# Altium project SJ2088POE.PrjPcb (part 9 of 9)

## Sheet SJ2088POE_IMU.SchDoc: =project_title
size Tabloid; CompanyName: Luxonis Holding; DrawnBy: Brian Weinstein / Sandesh Joshi; Organization: Luxonis Holding; Address1: 1925 Harmony Park Drive; Address2: Westminster, CO; Address3: 80234; Address4: United States; DocumentNumber: D2088000; SheetNumber: 4; SheetTotal: 11
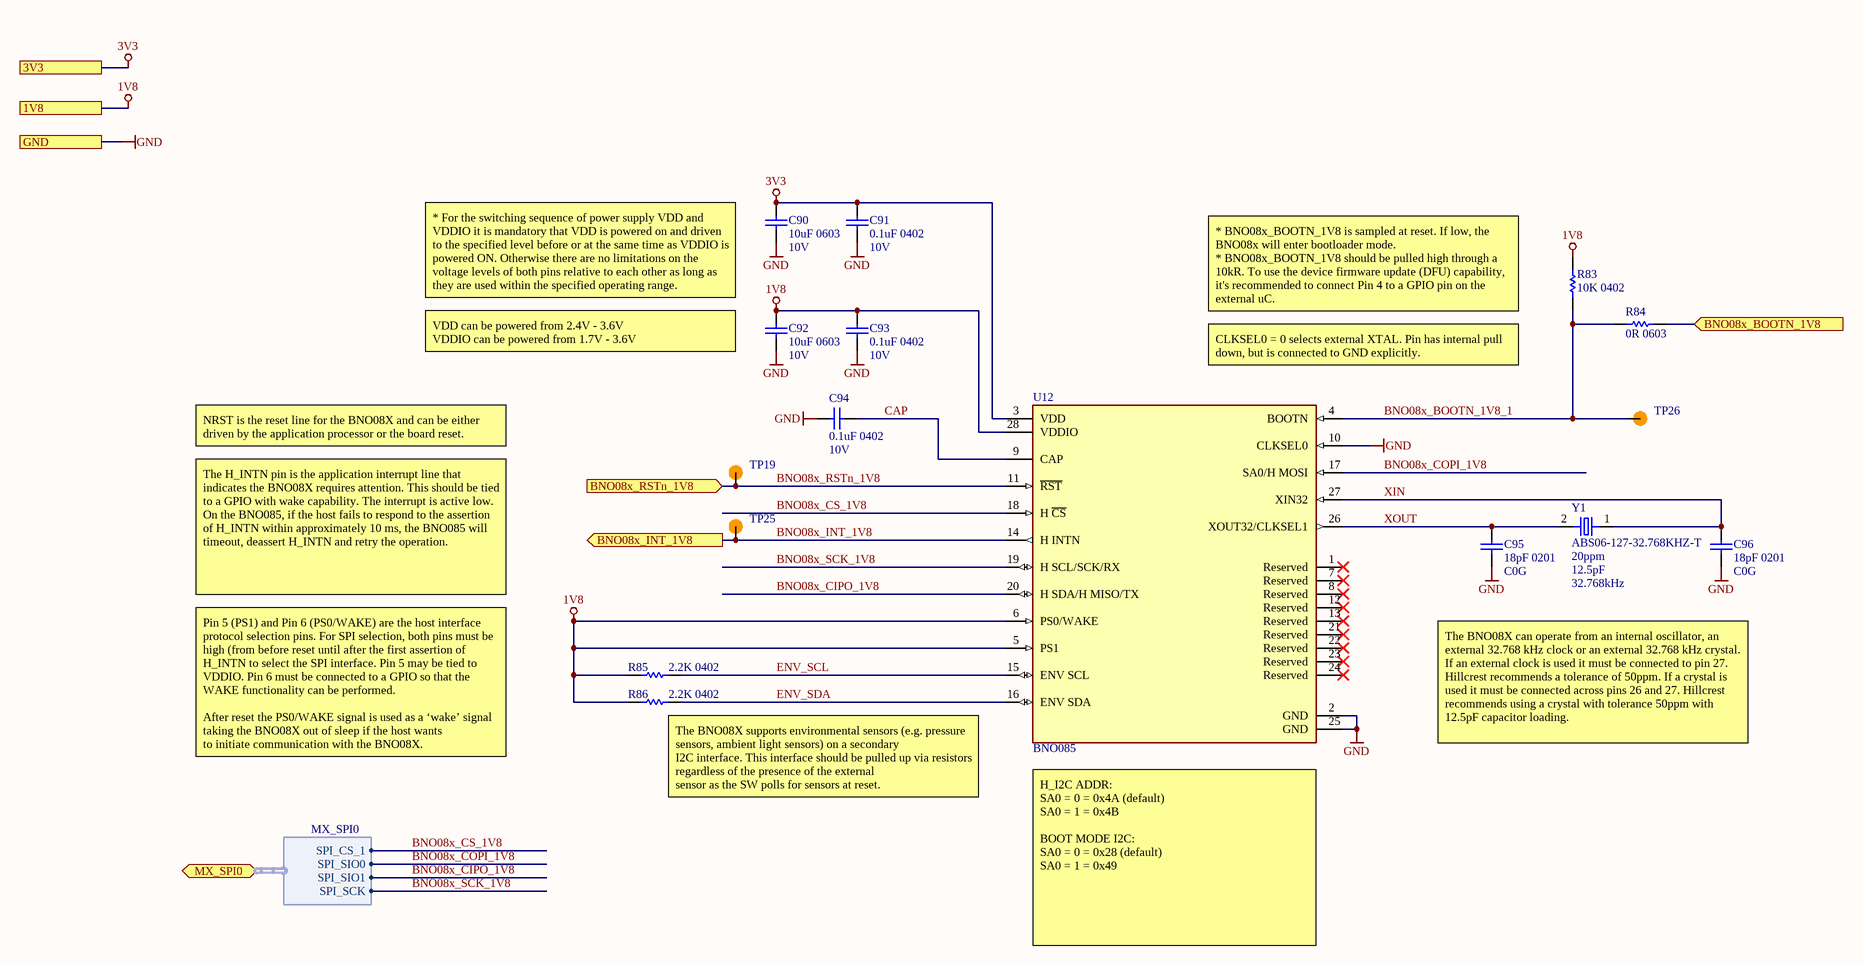
[diagram p14: SJ2088POE_IMU.SchDoc]

### Parts
C90  10uF 0603  Voltage Rating: 10V  [CAPC0603(1608)100_L]
C91  0.1uF 0402  Voltage Rating: 10V  [CAPC0402(1005)70_L]
C92  10uF 0603  Voltage Rating: 10V  [CAPC0603(1608)100_L]
C93  0.1uF 0402  Voltage Rating: 10V  [CAPC0402(1005)70_L]
C94  0.1uF 0402  Voltage Rating: 10V  [CAPC0402(1005)70_L]
C95  18pF 0201  Dielectric: C0G  [CAPC0201(0603)33_L]
C96  18pF 0201  Dielectric: C0G  [CAPC0201(0603)33_L]
R83  10K 0402  [RESC0402(1005)_L]
R84  0R 0603  [RESC0603(1608)_L]
R85  2.2K 0402  [RESC0402(1005)_L]
R86  2.2K 0402  [RESC0402(1005)_L]
TP19  TP100_200_NS  [TP100_200_NS]  (value not drawn)  (no BOM)
TP25  TP100_200_NS  [TP100_200_NS]  (value not drawn)  (no BOM)
TP26  TP100_200_NS  [TP100_200_NS]  (value not drawn)  (no BOM)
U12  BNO085  [BNO085]
Y1  ABS06-127-32.768KHZ-T  Frequency Tolerance: 20ppm  Load Capacitance: 12.5pF  Frequency: 32.768kHz  [ABS06-127-32.768KHZ-T]

### Ports
1V8, 3V3, BNO08x_BOOTN_1V8 (in), BNO08x_INT_1V8 (out), BNO08x_RSTn_1V8 (in), GND, MX_SPI0 (bidir, harness MX_SPI0)

### Harnesses
MX_SPI0: SPI_SIO0, SPI_SIO1, SPI_CS_1, SPI_SCK

### Nets
1V8: C92.2 C93.2 R83.2 R85.1 R86.1 U12.5(PS1) U12.6(PS0/WAKE) U12.28(VDDIO) ; port 1V8
3V3: C90.2 C91.2 U12.3(VDD) ; port 3V3
GND: C90.1 C91.1 C92.1 C93.1 C94.2 C95.1 C96.1 U12.2(GND) U12.10(CLKSEL0) U12.25(GND) ; port GND
BNO08x_BOOTN_1V8: R84.2 ; port BNO08x_BOOTN_1V8
BNO08x_BOOTN_1V8_1: R83.1 R84.1 TP26.1 U12.4(BOOTN)
BNO08x_CIPO_1V8: U12.20(H_SDA/H_MISO/TX) ; port MX_SPI0.SPI_SIO1
BNO08x_COPI_1V8: U12.17(SA0/H_MOSI) ; port MX_SPI0.SPI_SIO0
BNO08x_CS_1V8: U12.18(H_~{CS}) ; port MX_SPI0.SPI_CS_1
BNO08x_INT_1V8: TP25.1 U12.14(H_INTN) ; port BNO08x_INT_1V8
BNO08x_RSTn_1V8: TP19.1 U12.11(~{RST}) ; port BNO08x_RSTn_1V8
BNO08x_SCK_1V8: U12.19(H_SCL/SCK/RX) ; port MX_SPI0.SPI_SCK
CAP: C94.1 U12.9(CAP)
ENV_SCL: R85.2 U12.15(ENV_SCL)
ENV_SDA: R86.2 U12.16(ENV_SDA)
XIN: C96.2 U12.27(XIN32) Y1.1
XOUT: C95.2 U12.26(XOUT32/CLKSEL1) Y1.2

Not connected (* = marked no-connect by the designer): U12 1(Reserved)* 7(Reserved)* 8(Reserved)* 12(Reserved)* 13(Reserved)* 21(Reserved)* 22(Reserved)* 23(Reserved)* 24(Reserved)*

### Notes on the sheet
- * For the switching sequence of power supply VDD and VDDIO it is mandatory that VDD is powered on and driven to the specified level before or at the same time as VDDIO is powered ON. Otherwise there are no limitations on the voltage levels of both pins relative to each other as long as they are used within the specified operating range.
- (near C92) VDD can be powered from 2.4V - 3.6V
  VDDIO can be powered from 1.7V - 3.6V
- * BNO08x_BOOTN_1V8 is sampled at reset. If low, the BNO08x will enter bootloader mode.
  * BNO08x_BOOTN_1V8 should be pulled high through a 10kR. To use the device firmware update (DFU) capability, it's recommended to connect Pin 4 to a GPIO pin on the external uC.
- CLKSEL0 = 0 selects external XTAL. Pin has internal pull down, but is connected to GND explicitly.
- NRST is the reset line for the BNO08X and can be either driven by the application processor or the board reset.
- The H_INTN pin is the application interrupt line that indicates the BNO08X requires attention. This should be tied to a GPIO with wake capability. The interrupt is active low. On the BNO085, if the host fails to respond to the assertion of H_INTN within approximately 10 ms, the BNO085 will timeout, deassert H_INTN and retry the operation.
- Pin 5 (PS1) and Pin 6 (PS0/WAKE) are the host interface protocol selection pins. For SPI selection, both pins must be high (from before reset until after the first assertion of H_INTN to select the SPI interface. Pin 5 may be tied to VDDIO. Pin 6 must be connected to a GPIO so that the WAKE functionality can be performed.
  After reset the PS0/WAKE signal is used as a ‘wake’ signal taking the BNO08X out of sleep if the host wants
  to initiate communication with the BNO08X.
- The BNO08X can operate from an internal oscillator, an external 32.768 kHz clock or an external 32.768 kHz crystal. If an external clock is used it must be connected to pin 27. Hillcrest recommends a tolerance of 50ppm. If a crystal is used it must be connected across pins 26 and 27. Hillcrest recommends using a crystal with tolerance 50ppm with 12.5pF capacitor loading.
- (near R86) The BNO08X supports environmental sensors (e.g. pressure sensors, ambient light sensors) on a secondary
  I2C interface. This interface should be pulled up via resistors regardless of the presence of the external
  sensor as the SW polls for sensors at reset.
- (near U12) H_I2C ADDR:
  SA0 = 0 = 0x4A (default)
  SA0 = 1 = 0x4B
  BOOT MODE I2C:
  SA0 = 0 = 0x28 (default)
  SA0 = 1 = 0x49
- Title
- Size:
- Date:
- Tabloid
- Number:
- Time:
- Revision:
- Sheet
- of
- Drawn by:

### Library data of the parts
C90 C92 = GRM188R61A106ME69D: CAP CER 10UF 10V X5R 0603 20%; Manufacturer 1: Murata; Material: Ceramic; Supplier 1: Digi-Key; Manufacturer Part Number 1: GRM188R61A106ME69D; Stock 1: 2873098; Pricing 1: 1=0.21000, 10=0.14100, 100=0.07130, 500=0.04876, 1000=0.04313 (USD); RoHS: Yes; Mount: Surface Mount; Case/Package: 0603; Weight: 0.000222oz; Case Code (Metric): 1608; Case Code (Imperial): 0603; Min Operating Temperature: -55°C; Max Operating Temperature: 85°C; Packaging: Tape and Reel; Tolerance: 20%; Capacitance: 10uF; Dielectric: X5R; Voltage Rating (DC): 10V; Package Quantity: 4000; Termination: SMD/SMT; Length: 1.6mm; Height: 0.8mm; Width: 0.8mm; Thickness: 0.035inch; Depth: 0.8mm; REACH SVHC: Unknown; Lead Free: Lead Free; ComponentLink1URL: http://www.mouser.com/ds/2/281/c02e-2905.pdf?src-supplier=Mouser; ComponentLink1Description: http://www.mouser.com/ds/2/281/c02e-2905.pdf?src-supplier=Mouser; ComponentLink2URL: http://components.arrow.com/part/dataview/0323_06119472?src-supplier=Arrow+Europe; ComponentLink2Description: http://components.arrow.com/part/dataview/0323_06119472?src-supplier=Arrow+Europe; ComponentLink3URL: http://www.farnell.com/datasheets/2048014.pdf?src-supplier=Farnell; ComponentLink3Description: http://www.farnell.com/datasheets/2048014.pdf?src-supplier=Farnell; ComponentLink4URL: http://www.farnell.com/datasheets/1872210.pdf?src-supplier=Farnell; ComponentLink4Description: http://www.farnell.com/datasheets/1872210.pdf?src-supplier=Farnell; ComponentLink5URL: http://search.murata.co.jp/Ceramy/image/img/A01X/G101/ENG/GRM188R61A106ME69-01.pdf?src-supplier=Digi-Key; ComponentLink5Description: http://search.murata.co.jp/Ceramy/image/img/A01X/G101/ENG/GRM188R61A106ME69-01.pdf?src-supplier=Digi-Key; ComponentLink6URL: http://www.farnell.com/datasheets/1872210.pdf?src-supplier=Newark; ComponentLink6Description: http://www.farnell.com/datasheets/1872210.pdf?src-supplier=Newark; ComponentLink7URL: http://www.farnell.com/datasheets/2048014.pdf?src-supplier=Element14; ComponentLink7Description: http://www.farnell.com/datasheets/2048014.pdf?src-supplier=Element14; ComponentLink8URL: http://www.farnell.com/datasheets/2048014.pdf?src-supplier=Newark; ComponentLink8Description: http://www.farnell.com/datasheets/2048014.pdf?src-supplier=Newark; Supplier Part Number 1: 490-10475-1-ND
C91 C93 C94 = GRM155R71A104JA01D: CAP CER 0.1UF 10V X7R 0402 5%; Manufacturer 1: Murata; Capacitance: 100nF; Supplier 1: Digi-Key; Manufacturer Part Number 1: GRM155R71A104JA01D; Stock 1: 1346709; Pricing 1: 1=0.10000, 10=0.02500, 100=0.01130, 500=0.00806, 1000=0.00633, 2500=0.00575, 5000=0.00529 (USD); RoHS: Yes; Mount: Surface Mount; Case/Package: 0402; Case Code (Imperial): 0402; Case Code (Metric): 1005; Min Operating Temperature: -55°C; Max Operating Temperature: 125°C; Tolerance: 5%; Packaging: Tape and Reel; Voltage Rating (DC): 10V; Dielectric: X7R; Package Quantity: 10000; Termination: SMD/SMT; Length: 1mm; Height: 0.5mm; Width: 0.02inch; Thickness: 0.022inch; Depth: 0.5mm; Radiation Hardening: No; Lead Free: Lead Free; ComponentLink1URL: https://datasheet.ciiva.com/5411/product-5411135.pdf?src-supplier=Mouser; ComponentLink1Description: https://datasheet.ciiva.com/5411/product-5411135.pdf?src-supplier=Mouser; ComponentLink2URL: https://datasheet.ciiva.com/11618/c02e-11618821.pdf?src-supplier=Avnet; ComponentLink2Description: https://datasheet.ciiva.com/11618/c02e-11618821.pdf?src-supplier=Avnet; Supplier Part Number 1: 490-10777-1-ND
C95 C96 = GRM0335C1E180FA01D: Cap Ceramic 18pF 25V C0G 1% Pad SMD 0201 125C T/R; Manufacturer 1: Murata; Supplier 1: Digi-Key; Manufacturer Part Number 1: GRM0335C1E180FA01D; RoHS: Yes; Category: Ceramic Capacitors; Stock 1: 27511; Pricing 1: 1=0.10000, 10=0.02100, 100=0.00930, 500=0.00666, 1000=0.00523, 2500=0.00476, 5000=0.00438 (USD); Mount: Surface Mount; Case/Package: 0201; Case Code (Imperial): 0201; Case Code (Metric): 0603; Min Operating Temperature: -55°C; Max Operating Temperature: 125°C; Capacitance: 18pF; Tolerance: 1%; Packaging: Tape and Reel; Voltage Rating (DC): 25V; Package Quantity: 15000; Voltage Rating: 25V; Termination: SMD/SMT; Length: 0.024inch; Height: 0.3mm; Thickness: 0.013inch; Width: 0.3mm; ComponentLink1URL: https://datasheet.ciiva.com/29538/partnumbering-e-01-29538328.pdf?src-supplier=Digi-Key; ComponentLink1Description: https://datasheet.ciiva.com/29538/partnumbering-e-01-29538328.pdf?src-supplier=Digi-Key; Supplier 2: Digi-Key; Supplier 3: Mouser; Supplier Part Number 3: 81-GRM0335C1E180FA1D; Supplier Part Number 2: 490-17804-2-ND; Supplier Part Number 1: 490-17804-1-ND
R83 = RC0402FR-1310KL: RES SMD 10K OHM 1% 0402 1/16W Chip Resistor, 0402 [1005 Metric], 10 kohm, RC Series, 50 V, Thick Film, 62.5 mW; Manufacturer 1: Yageo; Resistance: 10kR; Temperature Coefficient: 100ppm/°C; Power Rating: 62.5mW; Voltage Rating: 50V; ComponentLink1URL: https://datasheet.ciiva.com/16940/pyu-rc0402-51-rohs-l-6-16940293.pdf?src-supplier=Avnet+Europe; ComponentLink1Description: https://datasheet.ciiva.com/16940/pyu-rc0402-51-rohs-l-6-16940293.pdf?src-supplier=Avnet+Europe; ComponentLink2URL: https://datasheet.ciiva.com/28386/pyu-rc0402-51-rohs-l-6-28386855.pdf?src-supplier=Avnet+Europe; ComponentLink2Description: https://datasheet.ciiva.com/28386/pyu-rc0402-51-rohs-l-6-28386855.pdf?src-supplier=Avnet+Europe; ComponentLink3URL: https://datasheet.ciiva.com/16740/pyu-rc0402-51-rohs-l-6-r-16740602.pdf?src-supplier=Future+Electronics; ComponentLink3Description: https://datasheet.ciiva.com/16740/pyu-rc0402-51-rohs-l-6-r-16740602.pdf?src-supplier=Future+Electronics; ComponentLink4URL: https://datasheet.ciiva.com/8891/pyu-rc0402-51-rohs-l-6-8891339.pdf?src-supplier=Avnet; ComponentLink4Description: https://datasheet.ciiva.com/8891/pyu-rc0402-51-rohs-l-6-8891339.pdf?src-supplier=Avnet; ComponentLink5URL: https://datasheet.ciiva.com/5557/pyu-rc0402-51-rohs-l-6-r-5557997.pdf?src-supplier=Mouser; ComponentLink5Description: https://datasheet.ciiva.com/5557/pyu-rc0402-51-rohs-l-6-r-5557997.pdf?src-supplier=Mouser; ComponentLink6URL: https://datasheet.ciiva.com/7983/1018594-7983533.pdf?src-supplier=Element14; ComponentLink6Description: https://datasheet.ciiva.com/7983/1018594-7983533.pdf?src-supplier=Element14; Supplier 1: Newark; Manufacturer Part Number 1: RC0402FR-1310KL; Stock 1: 62239; Pricing 1: 1=0.10000, 25=0.01200, 100=0.00400, 250=0.00400, 500=0.00300, 1000=0.00300 (USD); RoHS: Yes; Case/Package: 0402; Number of Pins: 2; Contact Plating: Tin,Matte,Lead; Case Code (Imperial): 0402; Case Code (Metric): 1005; Min Operating Temperature: -55°C; Max Operating Temperature: 155°C; Tolerance: 1%; Composition: Thick Film; Packaging: Tape and Reel; Termination: SMD/SMT; Military Standard: Not; Voltage Rating (DC): 50V; Working Voltage: 50V; Number of Terminations: 2; Length: 1mm; Depth: 0.5mm; Radiation Hardening: No; REACH SVHC: No SVHC; Lead Free: Lead Free; Supplier Part Number 1: 67R9960; Supplier 2: Future Electronics; Supplier 3: Mouser; Supplier 4: Element14; Supplier Part Number 2: RC0402FR-1310KL-CUTT; Supplier Part Number 3: 603-RC0402FR-1310KL; Supplier Part Number 4: 1799235
R84 = CRCW06030000Z0EA: RES SMD 0 OHM JUMPER 1/10W 0603 0 Ohms Jumper 0.1W, 1/10W Chip Resistor 0603 (1608 Metric) Automotive AEC-Q200 Thick Film; Manufacturer 1: Vishay; Manufacturer Part Number 1: CRCW0603-0000Z0EA; Resistance: 0mR; Power Rating: 100mW; Voltage Rating: 75V; Temperature Coefficient: 100ppm/°C; Tolerance: 5%; Current Rating: 2A; Supplier 1: Digi-Key; Stock 1: 742743; Pricing 1: 1=0.100000, 10=0.034000, 25=0.024400, 50=0.018600, 100=0.013800, 250=0.010480, 500=0.008400, 1000=0.006180 (USD); RoHS: Yes; Mount: Surface Mount; Case/Package: 0603; Weight: 7.1E-05oz; Contact Plating: Tin,Lead; Case Code (Metric): 1608; Case Code (Imperial): 0603; Min Operating Temperature: -55°C; Max Operating Temperature: 155°C; Composition: Thick Film; Termination: SMD/SMT; Packaging: Tape and Reel; Package Quantity: 1; Number of Terminations: 2; Military Standard: Not; Max Power Dissipation: 100mW; Voltage Rating (DC): 75V; Features: Automotive AEC-Q200; Working Voltage: 75V; Length: 1.55mm; Height: 0.02inch; Width: 0.033inch; Depth: 0.85mm; Radiation Hardening: No; Lead Free: Lead Free; REACH SVHC: Unknown; ComponentLink1URL: https://datasheet.ciiva.com/2461/dcrcwe3-2461968.pdf?src-supplier=Digi-Key; ComponentLink1Description: https://datasheet.ciiva.com/2461/dcrcwe3-2461968.pdf?src-supplier=Digi-Key; ComponentLink2URL: https://datasheet.ciiva.com/2461/dcrcwe3-2461969.pdf?src-supplier=Digi-Key; ComponentLink2Description: https://datasheet.ciiva.com/2461/dcrcwe3-2461969.pdf?src-supplier=Digi-Key; ComponentLink3URL: https://datasheet.ciiva.com/2461/dcrcwe3-2461970.pdf?src-supplier=Digi-Key; ComponentLink3Description: https://datasheet.ciiva.com/2461/dcrcwe3-2461970.pdf?src-supplier=Digi-Key; ComponentLink4URL: https://datasheet.ciiva.com/8340/dcrcwe3-8340197.pdf?src-supplier=Avnet; ComponentLink4Description: https://datasheet.ciiva.com/8340/dcrcwe3-8340197.pdf?src-supplier=Avnet; ComponentLink5URL: https://datasheet.ciiva.com/16941/dcrcw-16941302.pdf?src-supplier=Avnet+Europe; ComponentLink5Description: https://datasheet.ciiva.com/16941/dcrcw-16941302.pdf?src-supplier=Avnet+Europe; ComponentLink6URL: https://datasheet.ciiva.com/16199/dcrcwe3-16199063.pdf?src-supplier=Future+Electronics; ComponentLink6Description: https://datasheet.ciiva.com/16199/dcrcwe3-16199063.pdf?src-supplier=Future+Electronics; ComponentLink7URL: https://datasheet.ciiva.com/16725/70201119-16725175.pdf?src-supplier=Allied+Electronics; ComponentLink7Description: https://datasheet.ciiva.com/16725/70201119-16725175.pdf?src-supplier=Allied+Electronics; ComponentLink8URL: https://datasheet.ciiva.com/26316/fld-crcw-e3-data-en-26316615.pdf?src-supplier=Distrelec; ComponentLink8Description: https://datasheet.ciiva.com/26316/fld-crcw-e3-data-en-26316615.pdf?src-supplier=Distrelec; ComponentLink9URL: https://datasheet.ciiva.com/5544/dcrcwe3-109170-5544344.pdf?src-supplier=Mouser; ComponentLink9Description: https://datasheet.ciiva.com/5544/dcrcwe3-109170-5544344.pdf?src-supplier=Mouser; ComponentLink10URL: https://datasheet.ciiva.com/7841/1720486-7841816.pdf?src-supplier=Element14; ComponentLink10Description: https://datasheet.ciiva.com/7841/1720486-7841816.pdf?src-supplier=Element14; ComponentLink11URL: https://datasheet.ciiva.com/7841/1720486-7841817.pdf?src-supplier=Element14; ComponentLink11Description: https://datasheet.ciiva.com/7841/1720486-7841817.pdf?src-supplier=Element14; ComponentLink12URL: https://datasheet.ciiva.com/7841/125364-7841818.pdf?src-supplier=Element14; ComponentLink12Description: https://datasheet.ciiva.com/7841/125364-7841818.pdf?src-supplier=Element14; ComponentLink13URL: https://datasheet.ciiva.com/16721/70201119-16721450.pdf?src-supplier=Allied+Electronics; ComponentLink13Description: https://datasheet.ciiva.com/16721/70201119-16721450.pdf?src-supplier=Allied+Electronics; Supplier Part Number 1: 541-0.0GCT-ND
R85 R86 = RC0402FR-072K2L: RES SMD 2.2K OHM 1% 1/16W 0402; Manufacturer 1: Yageo; Resistance: 2.2kR; Temperature Coefficient: 100ppm/°C; Power Rating: 63mW; Voltage Rating: 50V; Supplier 1: Digi-Key; Manufacturer Part Number 1: RC0402FR-072K2L; Stock 1: 12579098; Pricing 1: 1=0.10000, 10=0.01600, 100=0.00640, 1000=0.00289, 2500=0.00251, 5000=0.00207 (USD); RoHS: Yes; Case/Package: 0402; Weight: 2.3E-05oz; Case Code (Imperial): 0402; Case Code (Metric): 1005; Min Operating Temperature: -55°C; Max Operating Temperature: 155°C; Packaging: Tape and Reel; Tolerance: 1%; Composition: Thick Film; Termination: SMD/SMT; Military Standard: Not; Length: 1mm; Height: 0.35mm; Width: 0.5mm; Depth: 0.5mm; Lead Free: Lead Free; REACH SVHC: Unknown; ComponentLink1URL: https://datasheet.ciiva.com/11808/0900766b80c66297-11808786.pdf?src-supplier=RSComponents; ComponentLink1Description: https://datasheet.ciiva.com/11808/0900766b80c66297-11808786.pdf?src-supplier=RSComponents; ComponentLink2URL: https://datasheet.ciiva.com/12577/pyu-rc0402-51-rohs-l-6-r-12577429.pdf?src-supplier=Mouser; ComponentLink2Description: https://datasheet.ciiva.com/12577/pyu-rc0402-51-rohs-l-6-r-12577429.pdf?src-supplier=Mouser; ComponentLink3URL: https://datasheet.ciiva.com/16741/pyu-rc0402-51-rohs-l-6-r-16741015.pdf?src-supplier=Future+Electronics; ComponentLink3Description: https://datasheet.ciiva.com/16741/pyu-rc0402-51-rohs-l-6-r-16741015.pdf?src-supplier=Future+Electronics; ComponentLink4URL: https://datasheet.ciiva.com/7983/1018594-7983515.pdf?src-supplier=Element14; ComponentLink4Description: https://datasheet.ciiva.com/7983/1018594-7983515.pdf?src-supplier=Element14; ComponentLink5URL: https://datasheet.ciiva.com/46383/1018594-46383563.pdf?src-supplier=Element14; ComponentLink5Description: https://datasheet.ciiva.com/46383/1018594-46383563.pdf?src-supplier=Element14; ComponentLink6URL: https://datasheet.ciiva.com/7849/1018594-7849928.pdf?src-supplier=Element14; ComponentLink6Description: https://datasheet.ciiva.com/7849/1018594-7849928.pdf?src-supplier=Element14; ComponentLink7URL: https://datasheet.ciiva.com/7849/1018594-7849929.pdf?src-supplier=Element14; ComponentLink7Description: https://datasheet.ciiva.com/7849/1018594-7849929.pdf?src-supplier=Element14; Supplier 2: Mouser; Supplier 3: Newark; Supplier Part Number 1: 311-2.20KLRCT-ND; Supplier Part Number 2: 603-RC0402FR-072K2L; Supplier Part Number 3: 98K7523
TP19 TP25 TP26 = TEST_POINT
U12 = BNO085: IMU ACCEL/GYRO/MAG I2C 32BIT; Manufacturer 1: Hillcrest Laboratories; Sensor Type: Accelerometer,Gyroscope,Magnetometer; Output Type: SPI,I2C; Supplier 1: Digi-Key; Manufacturer Part Number 1: BNO085; RoHS: No; Category: Inertial Measurement Units (IMUs); Stock 1: 11593; Pricing 1: 1=11.85000, 5=10.31200, 10=9.28100, 25=8.25000, 50=7.63120, 100=6.60000, 500=6.18750, 1000=5.77500 (USD); Mount: Surface Mount; Case/Package: LGA; Min Operating Temperature: -40°C; Max Operating Temperature: 85°C; Packaging: Tape and Reel; ComponentLink1URL: https://www.hillcrestlabs.com/downloads/bno080-datasheet?src-supplier=Digi-Key; ComponentLink1Description: https://www.hillcrestlabs.com/downloads/bno080-datasheet?src-supplier=Digi-Key; ComponentLink2URL: https://www.hillcrestlabs.com/downloads/bno080-migration-guide?src-supplier=Digi-Key; ComponentLink2Description: https://www.hillcrestlabs.com/downloads/bno080-migration-guide?src-supplier=Digi-Key; Supplier Part Number 1: 1888-1006-1-ND
Y1 = ABS06-127-32.768KHZ-T: CRYSTAL 32.768kHz ±20ppm Crystal 12.5pF 90 kOhms 2-SMD, No Lead; Manufacturer 1: Abracon; ESR (Equivalent Series Resistance): 90kR; Supplier 1: Digi-Key; Manufacturer Part Number 1: ABS06-127-32.768KHZ-T; RoHS: Yes; Stock 1: 1640; Pricing 1: 1=0.69000, 10=0.60700, 50=0.56760, 100=0.50160, 500=0.47520, 1000=0.39600 (USD); Mount: Surface Mount; Case/Package: SMD/SMT; Min Operating Temperature: -40°C; Max Operating Temperature: 85°C; Packaging: Tape and Reel; ComponentLink1URL: http://www.farnell.com/datasheets/2614114.pdf?src-supplier=Farnell; ComponentLink1Description: http://www.farnell.com/datasheets/2614114.pdf?src-supplier=Farnell; ComponentLink2URL: https://abracon.com/datasheets/ABS06-127-32.768kHz-T.pdf?src-supplier=Digi-Key; ComponentLink2Description: https://abracon.com/datasheets/ABS06-127-32.768kHz-T.pdf?src-supplier=Digi-Key; ComponentLink3URL: http://www.farnell.com/datasheets/2614114.pdf?src-supplier=Newark; ComponentLink3Description: http://www.farnell.com/datasheets/2614114.pdf?src-supplier=Newark; Supplier 2: Digi-Key; Supplier 3: Mouser; Supplier 4: Verical; Supplier Part Number 1: 535-14513-1-ND; Supplier Part Number 2: 535-14513-6-ND; Supplier Part Number 3: 815-ABS0612732.768KT; Supplier Part Number 4: ABS06-127-32.768KHZ-T

## Nets that join several sheets
1V2: POWER_GEN (C64.2 TP22.1 U13.5), SJ2088POE_RIGHT_OV9282 (FB9.1), SJ2088POE_LEFT_OV9282 (FB6.1)
1V05: POWER_GEN (5 pins), SJ2088POE_IMX378 (FB12.1)
1V8: ETH_PCIE_PHY (C52.2 R50.2 U6.3), PCIE_CLK (C18.2 R6.2 U3.3), BOOT_JTAG_AUX (8 pins), POWER_GEN (C60.2 TP16.1 U10.5), SJ2088POE_IMX378 (FB11.1), SJ2088POE_RIGHT_OV9282 (FB8.1), SJ2088POE_LEFT_OV9282 (FB5.1), SJ2088POE_IMU (8 pins)
2V8: POWER_GEN (C66.2 TP23.1 U14.5), SJ2088POE_IMX378 (FB10.1), SJ2088POE_RIGHT_OV9282 (FB7.1), SJ2088POE_LEFT_OV9282 (FB4.1)
3V3: ETH_PCIE_PHY (15 pins), RJ45 (D16.2 J1.15 J1.17), PCIE_CLK (21 pins), SJ2088POE_USB (C74.2 R186.2 U61.6), BOOT_JTAG_AUX (C55.2 J4.9 J7.4), POWER_GEN (7 pins), SJ2088POE_IMU (C90.2 C91.2 U12.3)
5V_PoE: PoE_Si3404 (7 pins), POWER_GEN (TP3.1 U8.1 U11.3)
GND: TopLevel (6 pins), CONNECTOR_B (23 pins), CONNECTOR_A (20 pins), ETH_PCIE_PHY (24 pins), RJ45 (7 pins), PCIE_CLK (21 pins), SJ2088POE_USB (24 pins), BOOT_JTAG_AUX (21 pins), PoE_Si3404 (9 pins), POWER_GEN (27 pins), SJ2088POE_IMX378 (16 pins), SJ2088POE_RIGHT_OV9282 (16 pins), SJ2088POE_LEFT_OV9282 (16 pins), SJ2088POE_IMU (10 pins)
VBUS: CONNECTOR_B (J3.80), SJ2088POE_USB (10 pins), POWER_GEN (TP20.1 U8.3 U11.1)
VDD_5V: CONNECTOR_B (8 pins), SJ2088POE_USB (C76.2 R213.2 R214.2 U62.12), BOOT_JTAG_AUX (R53.2 R54.2 R55.2 R56.2), POWER_GEN (18 pins)
VNEG_IN: RJ45 (8 pins), PoE_Si3404 (C33.1 FB3.1)
2485_PGOOD: CONNECTOR_A (J2.37), BOOT_JTAG_AUX (J5.5 Q2.1)
2485_WAKEUP: CONNECTOR_A (J2.41), BOOT_JTAG_AUX (J5.7 R1.2 R62.1)
BNO08x_BOOTN_1V8: CONNECTOR_B (J3.42), SJ2088POE_IMU (R84.2)
BNO08x_CIPO_1V8: CONNECTOR_A (J2.64 TP28.1), SJ2088POE_IMU (U12.20)
BNO08x_COPI_1V8: CONNECTOR_A (J2.62 TP29.1), SJ2088POE_IMU (U12.17)
BNO08x_CS_1V8: CONNECTOR_A (J2.60 TP30.1), SJ2088POE_IMU (U12.18)
BNO08x_INT_1V8: CONNECTOR_A (J2.69), SJ2088POE_IMU (TP25.1 U12.14)
BNO08x_RSTn_1V8: CONNECTOR_B (J3.44), SJ2088POE_IMU (TP19.1 U12.11)
BNO08x_SCK_1V8: CONNECTOR_A (J2.74 TP27.1), SJ2088POE_IMU (U12.19)
BOOT0: CONNECTOR_B (J3.26), BOOT_JTAG_AUX (R23.1 SW1.6)
BOOT1: CONNECTOR_B (J3.24), BOOT_JTAG_AUX (R22.1 SW1.5)
BOOT2: CONNECTOR_B (J3.22), BOOT_JTAG_AUX (R21.1 SW1.4)
BOOT3: CONNECTOR_B (J3.20), BOOT_JTAG_AUX (R20.1 SW1.3)
BOOT4: CONNECTOR_B (J3.18), BOOT_JTAG_AUX (R19.1 SW1.2)
BRIDGE_REFCLK_N: ETH_PCIE_PHY (U4.16), PCIE_CLK (R33.1 R43.2)
BRIDGE_REFCLK_P: ETH_PCIE_PHY (U4.15), PCIE_CLK (R42.2 R65.1)
CAM_A_CLK_OUT: CONNECTOR_A (J2.28), SJ2088POE_IMX378 (J6.30)
CAM_A_PWDN_N: CONNECTOR_A (J2.34), SJ2088POE_IMX378 (J6.23 R70.1)
CAM_B_CLK_OUT: CONNECTOR_A (J2.73), SJ2088POE_RIGHT_OV9282 (J9.24), SJ2088POE_LEFT_OV9282 (J10.24)
CAM_B_D_PWM: CONNECTOR_A (J2.65), SJ2088POE_RIGHT_OV9282 (J9.22 R81.1)
CAM_B_PWDN_N: CONNECTOR_A (J2.67), SJ2088POE_LEFT_OV9282 (J10.22 R71.1)
COM_AUX_IO2: CONNECTOR_A (J2.42), SJ2088POE_LEFT_OV9282 (R80.1)
FSIN2: SJ2088POE_RIGHT_OV9282 (R82.2), SJ2088POE_LEFT_OV9282 (R77.2)
GPIO7/sd_hst_cd: CONNECTOR_A (J2.59), BOOT_JTAG_AUX (R66.2)
GPIO58: CONNECTOR_B (J3.28 R27.1), BOOT_JTAG_AUX (R63.1 SW1.1)
I2C0_SCL: CONNECTOR_B (J3.34), BOOT_JTAG_AUX (TP1.1)
I2C0_SDA: CONNECTOR_B (J3.36), BOOT_JTAG_AUX (TP2.1)
I2C1_SCL: CONNECTOR_A (J2.35), SJ2088POE_IMX378 (J6.20)
I2C1_SDA: CONNECTOR_A (J2.33), SJ2088POE_IMX378 (J6.19)
I2C2_SCL: CONNECTOR_A (J2.77), SJ2088POE_RIGHT_OV9282 (J9.21), SJ2088POE_LEFT_OV9282 (J10.21)
I2C2_SDA: CONNECTOR_A (J2.79), SJ2088POE_RIGHT_OV9282 (J9.20), SJ2088POE_LEFT_OV9282 (J10.20)
I2C3_SCL: CONNECTOR_A (J2.78), BOOT_JTAG_AUX (J5.2)
I2C3_SDA: CONNECTOR_A (J2.80), BOOT_JTAG_AUX (J5.4)
I2C4_SCL_1V8: CONNECTOR_B (J3.59), PCIE_CLK (U3.4)
I2C4_SDA_1V8: CONNECTOR_B (J3.57), PCIE_CLK (U3.5)
LED0_10_GRN: ETH_PCIE_PHY (U4.27), RJ45 (R57.1)
LED1_100_OR: ETH_PCIE_PHY (U4.26), RJ45 (R58.1)
LED2_1000_GRN: ETH_PCIE_PHY (U4.25), RJ45 (R59.1)
MD1_N: ETH_PCIE_PHY (U4.2), RJ45 (D17.2 D17.9 J1.2)
MD1_P: ETH_PCIE_PHY (U4.1), RJ45 (D17.1 D17.10 J1.1)
MD2_N: ETH_PCIE_PHY (U4.5), RJ45 (D17.5 D17.6 J1.6)
MD2_P: ETH_PCIE_PHY (U4.4), RJ45 (D17.4 D17.7 J1.3)
MD3_N: ETH_PCIE_PHY (U4.7), RJ45 (D18.2 D18.9 J1.8)
MD3_P: ETH_PCIE_PHY (U4.6), RJ45 (D18.1 D18.10 J1.7)
MD4_N: ETH_PCIE_PHY (U4.10), RJ45 (D18.5 D18.6 J1.10)
MD4_P: ETH_PCIE_PHY (U4.9), RJ45 (D18.4 D18.7 J1.9)
MIPI_RX2_C_N: CONNECTOR_A (J2.95), SJ2088POE_LEFT_OV9282 (J10.11)
MIPI_RX2_C_P: CONNECTOR_A (J2.97), SJ2088POE_LEFT_OV9282 (J10.10)
MIPI_RX2_D0_N: CONNECTOR_A (J2.89), SJ2088POE_LEFT_OV9282 (J10.8)
MIPI_RX2_D0_P: CONNECTOR_A (J2.91), SJ2088POE_LEFT_OV9282 (J10.7)
MIPI_RX2_D1_N: CONNECTOR_A (J2.83), SJ2088POE_LEFT_OV9282 (J10.5)
MIPI_RX2_D1_P: CONNECTOR_A (J2.85), SJ2088POE_LEFT_OV9282 (J10.4)
MIPI_RX3_C_N: CONNECTOR_A (J2.96), SJ2088POE_RIGHT_OV9282 (J9.11)
MIPI_RX3_C_P: CONNECTOR_A (J2.98), SJ2088POE_RIGHT_OV9282 (J9.10)
MIPI_RX3_D0_N: CONNECTOR_A (J2.90), SJ2088POE_RIGHT_OV9282 (J9.8)
MIPI_RX3_D0_P: CONNECTOR_A (J2.92), SJ2088POE_RIGHT_OV9282 (J9.7)
MIPI_RX3_D1_N: CONNECTOR_A (J2.84), SJ2088POE_RIGHT_OV9282 (J9.5)
MIPI_RX3_D1_P: CONNECTOR_A (J2.86), SJ2088POE_RIGHT_OV9282 (J9.4)
MIPI_RX4_C_N: CONNECTOR_A (J2.3), SJ2088POE_IMX378 (J6.28)
MIPI_RX4_C_P: CONNECTOR_A (J2.5), SJ2088POE_IMX378 (J6.27)
MIPI_RX4_D0_N: CONNECTOR_A (J2.9), SJ2088POE_IMX378 (J6.5)
MIPI_RX4_D0_P: CONNECTOR_A (J2.11), SJ2088POE_IMX378 (J6.6)
MIPI_RX4_D1_N: CONNECTOR_A (J2.15), SJ2088POE_IMX378 (J6.26)
MIPI_RX4_D1_P: CONNECTOR_A (J2.17), SJ2088POE_IMX378 (J6.25)
MIPI_RX5_D0_N: CONNECTOR_A (J2.21), SJ2088POE_IMX378 (J6.8)
MIPI_RX5_D0_P: CONNECTOR_A (J2.23), SJ2088POE_IMX378 (J6.9)
MIPI_RX5_D1_N: CONNECTOR_A (J2.27), SJ2088POE_IMX378 (J6.2)
MIPI_RX5_D1_P: CONNECTOR_A (J2.29), SJ2088POE_IMX378 (J6.3)
MODULE_nRST: CONNECTOR_A (B1.2 J2.39), BOOT_JTAG_AUX (J5.1 Q4.1)
PCIe_CLKREQ_N_1V8: CONNECTOR_B (J3.65), ETH_PCIE_PHY (U6.4)
PCIe_ISOLATE_N_1V8: CONNECTOR_B (R27.2), ETH_PCIE_PHY (U6.5)
PCIe_PERST_1V8: CONNECTOR_B (J3.63), ETH_PCIE_PHY (Q1.1)
sd_hst0_clk: CONNECTOR_A (J2.61), BOOT_JTAG_AUX (J7.5)
sd_hst0_cmd: CONNECTOR_A (J2.63), BOOT_JTAG_AUX (J7.3)
sd_hst0_dat_0: CONNECTOR_A (J2.40), BOOT_JTAG_AUX (J7.7)
sd_hst0_dat_1: CONNECTOR_A (J2.38), BOOT_JTAG_AUX (J7.8)
sd_hst0_dat_2: CONNECTOR_A (J2.36), BOOT_JTAG_AUX (J7.1)
sd_hst0_dat_3: CONNECTOR_A (J2.32), BOOT_JTAG_AUX (J7.2)
SDS_IO_CLKI_N: CONNECTOR_B (J3.81), PCIE_CLK (R36.1 R41.2)
SDS_IO_CLKI_P: CONNECTOR_B (J3.83), PCIE_CLK (R34.1 R40.1)
SDS_RXD_N: CONNECTOR_B (J3.77), ETH_PCIE_PHY (C51.1)
SDS_RXD_P: CONNECTOR_B (J3.75), ETH_PCIE_PHY (C35.1)
SDS_TXD_N: CONNECTOR_B (J3.71), ETH_PCIE_PHY (U4.14)
SDS_TXD_P: CONNECTOR_B (J3.69), ETH_PCIE_PHY (U4.13)
SYS_RST: CONNECTOR_B (J3.89), BOOT_JTAG_AUX (J4.6)
TCK: CONNECTOR_B (J3.97), BOOT_JTAG_AUX (J4.2)
TDI: CONNECTOR_B (J3.95), BOOT_JTAG_AUX (J4.3)
TDO: CONNECTOR_B (J3.91), BOOT_JTAG_AUX (J4.5)
TMS: CONNECTOR_B (J3.99), BOOT_JTAG_AUX (J4.1)
TRST: CONNECTOR_B (J3.93), BOOT_JTAG_AUX (J4.4)
USB_D_N: CONNECTOR_B (J3.90), SJ2088POE_USB (J14.A7 J14.B7)
USB_D_P: CONNECTOR_B (J3.92), SJ2088POE_USB (J14.A6 J14.B6)
USB_RX_N: CONNECTOR_B (J3.96), SJ2088POE_USB (U61.4)
USB_RX_P: CONNECTOR_B (J3.98), SJ2088POE_USB (U61.3)
USB_TX_N: CONNECTOR_B (J3.84), SJ2088POE_USB (U61.8)
USB_TX_P: CONNECTOR_B (J3.86), SJ2088POE_USB (U61.7)
VPOS_IN: RJ45 (8 pins), PoE_Si3404 (C33.2 FB2.1)

## Assembly variants
Production: not fitted R1 R38 R39 R47 R66 R67 RZ28 RZ29